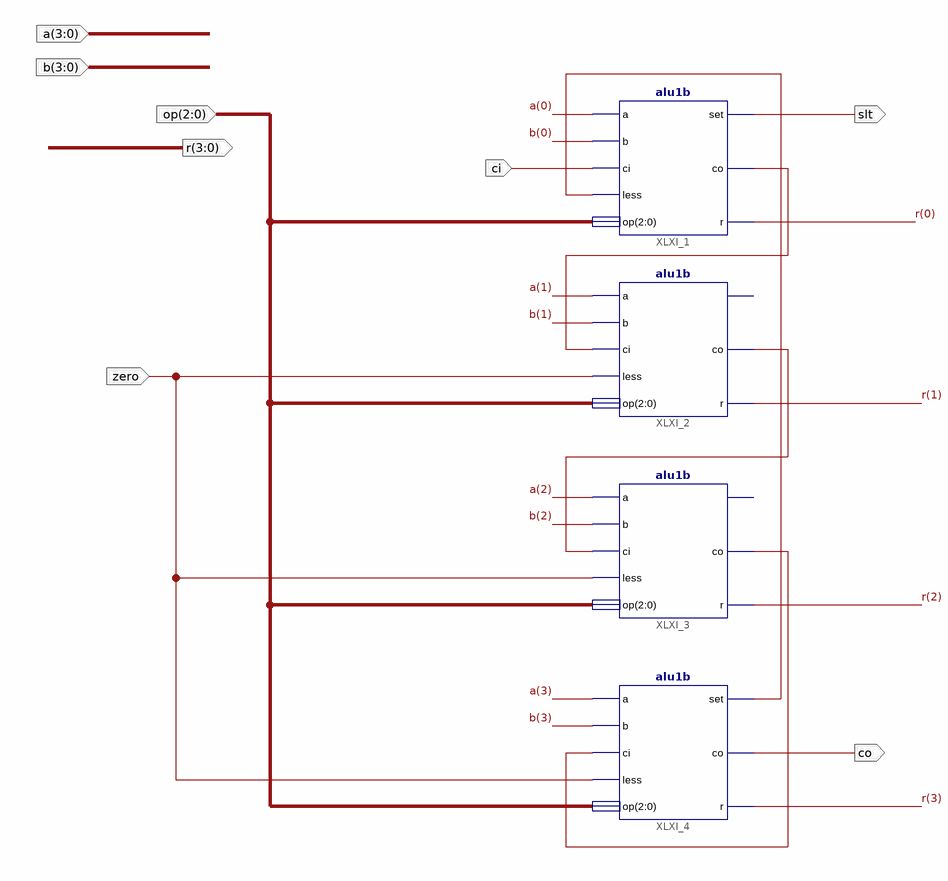
[diagram p0: schematic sheet 1]
// Xilinx ISE schematic alu.sch (spartan3e) as structural Verilog: 4 symbols, 8 ports
module alu (
  input  [3:0] a,
  input  [3:0] b,
  input  ci,
  input  zero,
  input  [2:0] op,
  output [3:0] r,
  output slt,
  output co
);

  wire XLXN_17, XLXN_18, XLXN_19, XLXN_20;

  alu1b XLXI_1 (.a(a[0]), .b(b[0]), .ci(ci), .less(XLXN_20), .op(op), .set(slt), .co(XLXN_17), .r(r[0]));
  alu1b XLXI_2 (.a(a[1]), .b(b[1]), .ci(XLXN_17), .less(zero), .op(op), .co(XLXN_18), .r(r[1]));  // open: set
  alu1b XLXI_3 (.a(a[2]), .b(b[2]), .ci(XLXN_18), .less(zero), .op(op), .co(XLXN_19), .r(r[2]));  // open: set
  alu1b XLXI_4 (.a(a[3]), .b(b[3]), .ci(XLXN_19), .less(zero), .op(op), .set(XLXN_20), .co(co), .r(r[3]));
endmodule
